# EAGLE design common_board_smd (EAGLE 6.5.0)
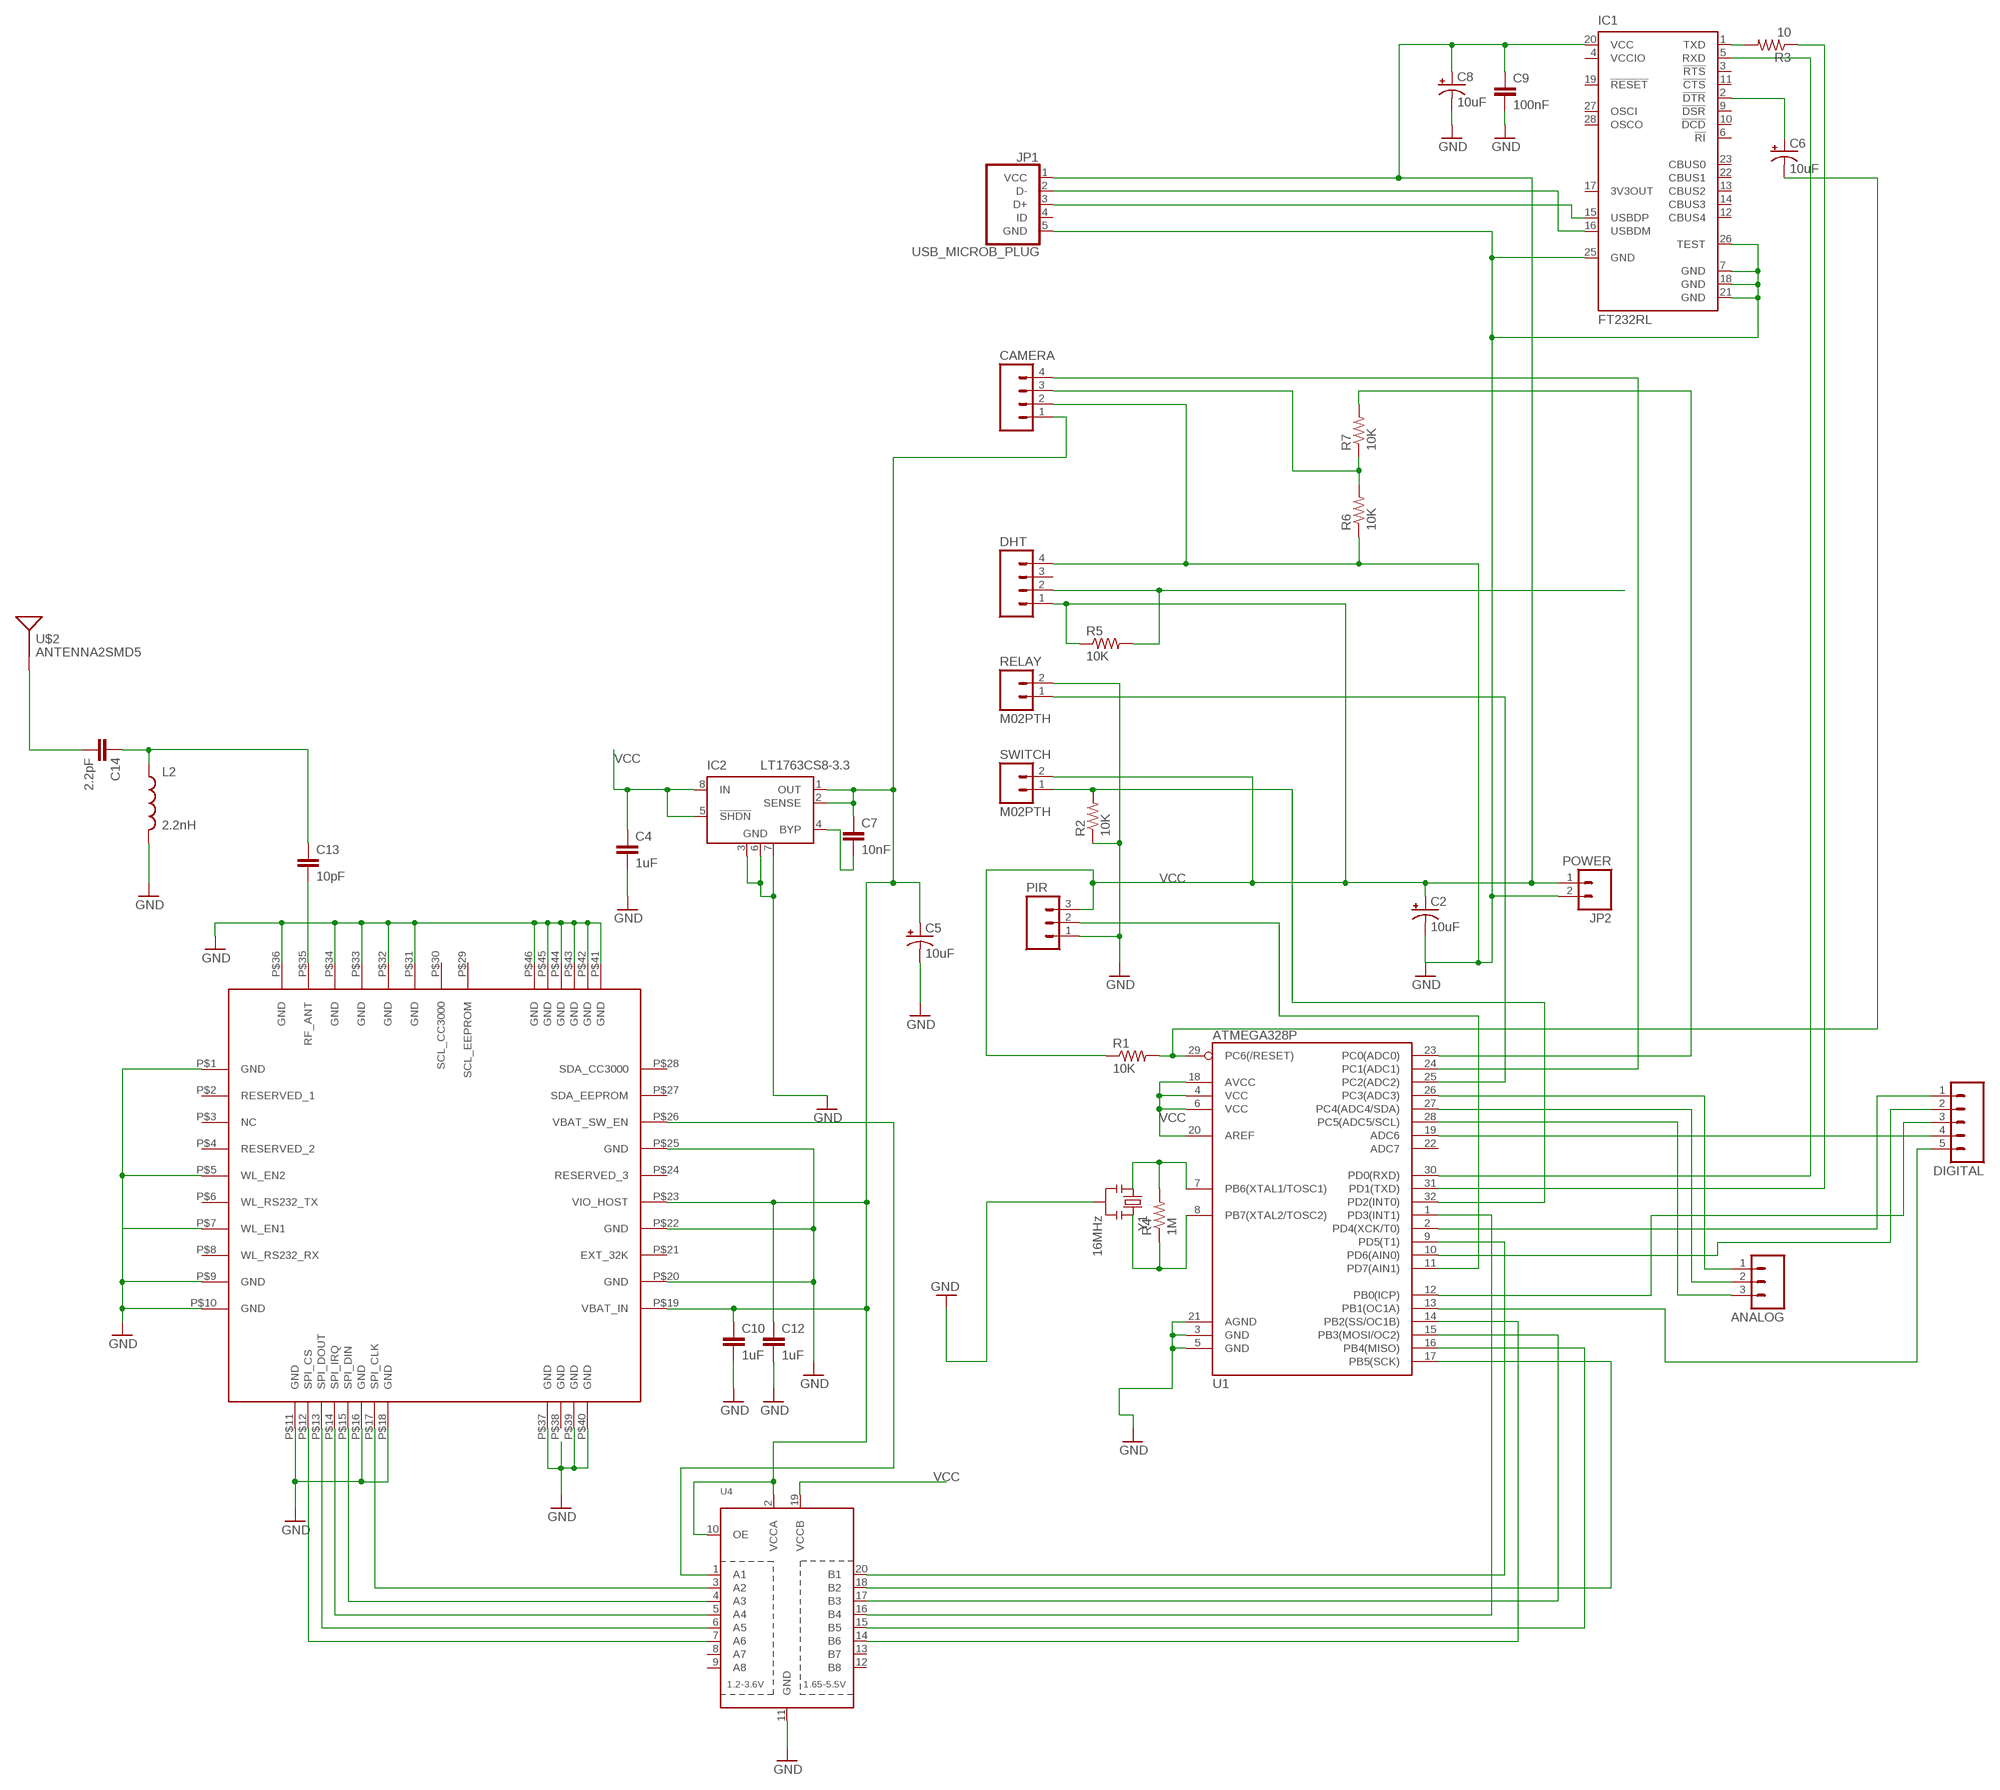
[diagram p0: schematic, sheet 1]

## Parts
ANALOG  M03PTH  [1X03]
C2  10uF  CAP_POL1206  [EIA3216]
C4  1uF  CAP0805  [0805]
C5  10uF  CAP_POL3528  [EIA3528]
C6  10uF  CAP_POL1206  [EIA3216]
C7  10nF  CAP0805  [0805]
C8  10uF  CAP_POL1206  [EIA3216]
C9  100nF  CAP0805  [0805]
C10  1uF  CAP1206  [1206]
C12  1uF  CAP1206  [1206]
C13  10pF  CAP0805  [0805]
C14  2.2pF  CAP0805  [0805]
CAMERA  M04PTH  [1X04]
DHT  M04PTH  [1X04]
DIGITAL  M05PTH  [1X05]
IC1  FT232RL  [SSOP28]
IC2  LT1763CS8-3.3  [SOIC8]
JP1  USB_MICROB_PLUG  [MICRO-B-RA-SMT]
JP2  POWER  M02PTH  [1X02]
L2  2.2nH  INDUCTOR0805  [0805]
PIR  M03PTH  [1X03]
R1  10K  RESISTOR0805-RES  [0805]
R2  10K  RESISTOR0805-RES  [0805]
R3  10  RESISTOR0805-RES  [0805]
R4  1M  RESISTOR0603-RES  [0603-RES]
R5  10K  RESISTOR0805-RES  [0805]
R6  10K  RESISTOR0805-RES  [0805]
R7  10K  RESISTOR0805-RES  [0805]
RELAY  M02PTH  [1X02]
SWITCH  M02PTH  [1X02]
U1  ATMEGA328P  ATMEGA328_SMT  [TQFP32-08]
U4  TXB0108PWR  [TSSOP20]
U$1  CC3000  [CC3000]
U$2  ANTENNA2SMD5  [ANTENNA-CHIP5]
Y1  16MHz  RESONATOR16MHZ  [RESONATOR-SMD]

## Nets
GND [gnd]: C2.C(-) C4.2 C5.C(-) C8.C(-) C9.2 C10.2 C12.2 CAMERA.2 DHT.4 IC1.7(GND) IC1.18(GND) IC1.21(GND) IC1.25(GND) IC1.26(TEST) IC2.3(GND) IC2.6(GND) IC2.7(GND) JP1.5(GND) JP2.2 L2.2 PIR.1 R2.1 R6.1 RELAY.2 U1.3(GND) U1.5(GND) U1.21(AGND) U4.11(GND) U$1.P$1(GND) U$1.P$5(WL_EN2) U$1.P$7(WL_EN1) U$1.P$9(GND) U$1.P$10(GND) U$1.P$11(GND) U$1.P$16(GND) U$1.P$18(GND) U$1.P$20(GND) U$1.P$22(GND) U$1.P$25(GND) U$1.P$31(GND) U$1.P$32(GND) U$1.P$33(GND) U$1.P$34(GND) U$1.P$36(GND) U$1.P$37(GND) U$1.P$39(GND) U$1.P$40(GND) U$1.P$41(GND) U$1.P$42(GND) U$1.P$43(GND) U$1.P$44(GND) U$1.P$45(GND) U$1.P$46(GND) Y1.2
N$1: U1.9(PD5(T1)) U4.20(B1)
N$2: U1.1(PD3(INT1)) U4.16(B4)
N$3: C6.C(-) R1.2 U1.29(PC6(/RESET))
N$4: R4.2 U1.7(PB6(XTAL1/TOSC1)) Y1.1
N$5: U1.17(PB5(SCK)) U4.18(B2)
N$6: U1.14(PB2(SS/OC1B)) U4.14(B6)
N$8: C5.A(+) C7.1 C10.1 C12.1 CAMERA.1 IC2.1(OUT) IC2.2(SENSE) U4.2(VCCA) U4.10(OE) U$1.P$19(VBAT_IN) U$1.P$23(VIO_HOST)
N$9: U4.7(A6) U$1.P$12(SPI_CS)
N$10: U4.6(A5) U$1.P$13(SPI_DOUT)
N$11: U4.5(A4) U$1.P$14(SPI_IRQ)
N$12: U4.4(A3) U$1.P$15(SPI_DIN)
N$13: U4.3(A2) U$1.P$17(SPI_CLK)
N$14: U4.1(A1) U$1.P$26(VBAT_SW_EN)
N$15: IC1.1(TXD) R3.2
N$16: C13.2 U$1.P$35(RF_ANT)
N$17: C13.1 C14.1 L2.1
N$18: C14.2 U$2.FEED(SIGNAL)
N$19: U1.16(PB4(MISO)) U4.15(B5)
N$20: U1.15(PB3(MOSI/OC2)) U4.17(B3)
N$21: R2.2 SWITCH.1 U1.32(PD2(INT0))
N$22: DHT.2 R5.2
N$23: RELAY.1 U1.25(PC2(ADC2))
N$24: CAMERA.3 R6.2 R7.1
N$25: R7.2 U1.23(PC0(ADC0))
N$26: PIR.2 U1.11(PD7(AIN1))
N$27: CAMERA.4 U1.24(PC1(ADC1))
N$28: IC1.15(USBDP) JP1.3(D+)
N$29: IC1.16(USBDM) JP1.2(D-)
N$30: R3.1 U1.31(PD1(TXD))
N$31: IC1.5(RXD) U1.30(PD0(RXD))
N$32: C6.A(+) IC1.2(!DTR)
N$33: ANALOG.1 U1.26(PC3(ADC3))
N$34: ANALOG.2 U1.27(PC4(ADC4/SDA))
N$35: ANALOG.3 U1.28(PC5(ADC5/SCL))
N$36: DIGITAL.5 U1.13(PB1(OC1A))
N$37: DIGITAL.3 U1.12(PB0(ICP))
N$38: DIGITAL.1 U1.2(PD4(XCK/T0))
N$39: DIGITAL.2 U1.10(PD6(AIN0))
N$40: DIGITAL.4 U1.19(ADC6)
N$41: R4.1 U1.8(PB7(XTAL2/TOSC2)) Y1.3
N$42: C7.2 IC2.4(BYP)
VCC [usbvcc]: C2.A(+) C4.1 C8.A(+) C9.1 DHT.1 IC1.20(VCC) IC2.5(!SHDN) IC2.8(IN) JP1.1(VCC) JP2.1 PIR.3 R1.1 R5.1 SWITCH.2 U1.4(VCC) U1.6(VCC) U1.18(AVCC) U1.20(AREF) U4.19(VCCB)
Unconnected: DHT.3 IC1.3(!RTS) IC1.6(!RI) IC1.9(!DSR) IC1.10(!DCD) IC1.11(!CTS) IC1.12(CBUS4) IC1.13(CBUS2) IC1.14(CBUS3) IC1.17(3V3OUT) IC1.19(!RESET) IC1.22(CBUS1) IC1.23(CBUS0) IC1.27(OSCI) IC1.28(OSCO) JP1.4(ID) U1.22(ADC7) U4.8(A7) U4.9(A8) U4.12(B8) U4.13(B7) U$1.P$2(RESERVED_1) U$1.P$3(NC) U$1.P$4(RESERVED_2) U$1.P$6(WL_RS232_TX) U$1.P$8(WL_RS232_RX) U$1.P$21(EXT_32K) U$1.P$24(RESERVED_3) U$1.P$27(SDA_EEPROM) U$1.P$28(SDA_CC3000) U$1.P$38(GND)

## Power pins joined to a net without a drawn wire
SCL_CC3000: U$1.P$30(SCL_CC3000)
SCL_EEPROM: U$1.P$29(SCL_EEPROM)
VCCIO: IC1.4(VCCIO)

## Library data of the parts
ANALOG PIR = SparkFun-Connectors:M03: Header 3 Standard 3-pin 0.1" header. Use with straight break away headers (SKU : PRT-00116), right angle break away headers (PRT-00553), swiss pins (PRT-00743), machine pins (PRT-00117), and female headers (PRT-00115). Molex polarized connector foot print use with SKU : PRT-08232 with associated crimp pins and housings.
C2 C5 C6 C8 = SparkFun-Passives:CAP_POL: Capacitor Polarized These are standard SMD and PTH capacitors. Normally 10uF, 47uF, and 100uF in electrolytic and tantalum varieties. Always verify the external diameter of the through hole cap, it varies with capacity, voltage, and manufacturer. The EIA devices should be standard.
C4 C7 C9 C10 C12-C14 = SparkFun-Capacitors:CAP: Capacitor Standard 0603 ceramic capacitor, and 0.1" leaded capacitor.
CAMERA DHT = SparkFun-Connectors:M04: Header 4 Standard 4-pin 0.1" header. Use with straight break away headers (SKU : PRT-00116), right angle break away headers (PRT-00553), swiss pins (PRT-00743), machine pins (PRT-00117), and female headers (PRT-00115). Molex polarized connector foot print use with SKU : PRT-08231 with associated crimp pins and housings. 1MM SMD Version SKU: PRT-10208
DIGITAL = SparkFun-Connectors:M05: Header 5 Standard 5-pin 0.1" header. Use with straight break away headers (SKU : PRT-00116), right angle break away headers (PRT-00553), swiss pins (PRT-00743), machine pins (PRT-00117), and female headers (PRT-00115). Molex polarized connector foot print use with SKU : PRT-08230 with associated crimp pins and housings.
IC1 = ftdichip:FT232R: Source: http://www.ftdichip.com/Documents/DataSheets/DS_FT232R_v104.pdf; MPN: FT232RL; OC_FARNELL: 1146032; OC_NEWARK: 91K9918
IC2 = linear-technology:LT1763CS8: 500mA, Low Noise, LDO Micropower Regulators Source: http://cds.linear.com/docs/Datasheet/1763ff.pdf; MPN: LT1763CS8-3.3; OC_FARNELL: 1273617; OC_NEWARK: 57M6055
JP1 = SparkFun-Connectors:USB_MICROB_PLUG: USB Micro-B Plug Comes in a variety of packages. Check out Hirose's ZX-x0 line: http://www.hirose.co.jp/cataloge_hp/e24200011.pdf
JP2 RELAY SWITCH = SparkFun-Connectors:M02: Standard 2-pin 0.1" header. Use with - straight break away headers ( PRT-00116) - right angle break away headers (PRT-00553) - swiss pins (PRT-00743) - machine pins (PRT-00117) - female headers (PRT-00115) Molex polarized connector foot print use with: PRT-08233 with associated crimp pins and housings. 2.54_SCREWTERM for use with PRT-10571. 3.5mm Screw Terminal footprints for PRT-08084 5mm Screw Terminal footprints for use with PRT-08433
L2 = SparkFun-Passives:INDUCTOR: Inductors Basic Inductor/Choke - 0603 and 1206. Footprints are not proven and vary greatly between part numbers. SRN6045- 33uH, 20% 1.4A
R1-R3 R5-R7 = SparkFun-Passives:RESISTOR: Resistor Basic schematic elements and footprints for 0603, 1206, and PTH resistors.
R4 = SparkFun-Resistors:RESISTOR: Resistor Basic schematic elements and footprints for 0603, 1206, and PTH resistors.
U1 = SparkFun-DigitalIC:ATMEGA328_SMT: 32-Pin Atmega328 part Commonly used on Arduino compatible boards Available in QFP and QFN packages TQFP is IC-09069 QFN is non-stock; PROD_ID: IC-09069
U4 = adafruit:TXB0108PWR: 8-Bit Bi-Directional Level Shifter 1.2V-3.6V (VCCA) to 1.65V-5.5V (VCCB) bi-directional level shifter with auto direction sensing. Max data rate - VCCA 1.8V: 20Mbps (50ns), VCCA 3.3V: 100Mbps (10ns) Digikey: 296-21527-1-ND
U$1 = centerblack_engineering:CC3000: TI SimpleLink CC3000 Module - WiFi 802.11b/g Network Processor; AUTHOR: Matt Bigarani; DATASHEET: http://www.ti.com/lit/ds/symlink/cc3000.pdf; DATE: 2/8/2013
U$2 = SparkFun-RF-Modified:ANTENNA2: Chip antenna Single endded antenna. Common with smaller chip antennas. CHIP4 package is the GPS Chip Antenna SKU: GPS-08418. CHIP5 package is 2.4GHz chip antenna SKU: WRL-00144.
Y1 = SparkFun-FreqCtrl:RESONATOR: Resonator Small SMD resonator. Used, eg, on the Arduino Pro/ Pro Mini boards. 8MHz- XTAL-08895 16MHz- XTAL-08900; PROD_ID: XTAL-08900

## Net classes
0 default: width 0.152 mm, clearance 0.152 mm
1 power: width 0.61 mm, drill 0.61 mm, clearance 0.254 mm
2 gnd: width 0.203 mm, drill 0.559 mm, clearance 0.152 mm
3 usbvcc: width 0.203 mm, drill 0.61 mm, clearance 0.152 mm
4 aref: width 0.406 mm, drill 0.61 mm, clearance 0.254 mm

## Board
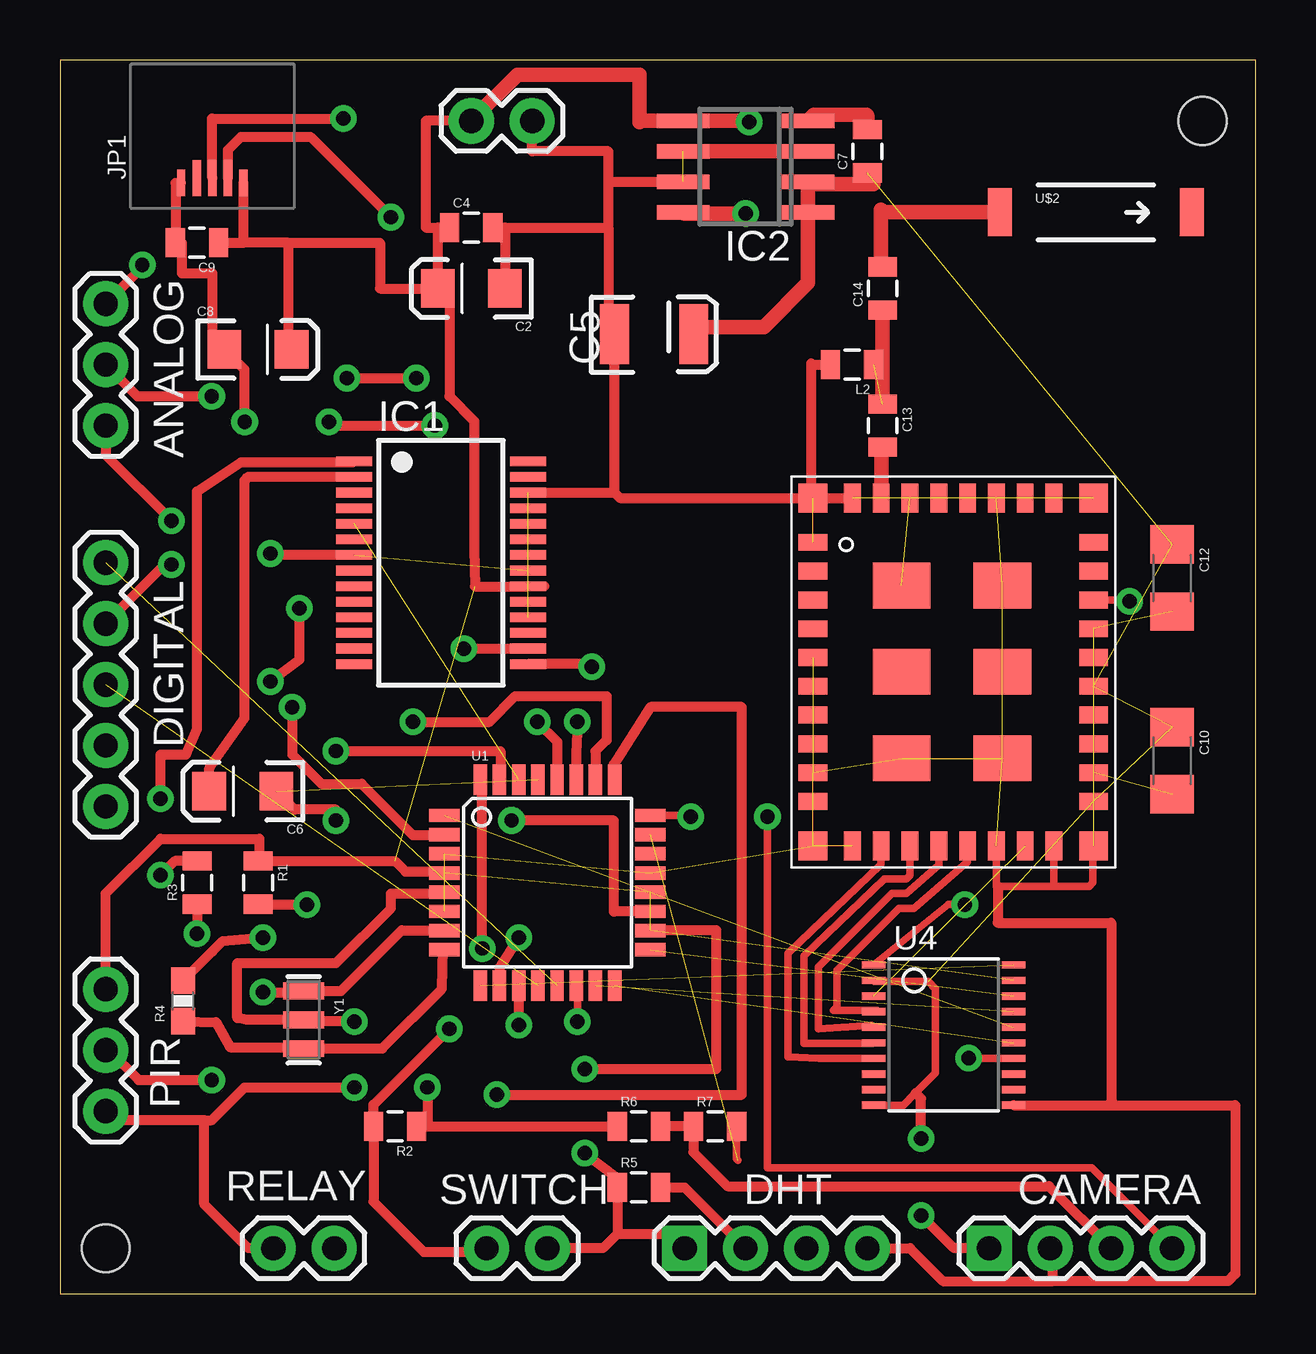
[diagram p1: board, top side]
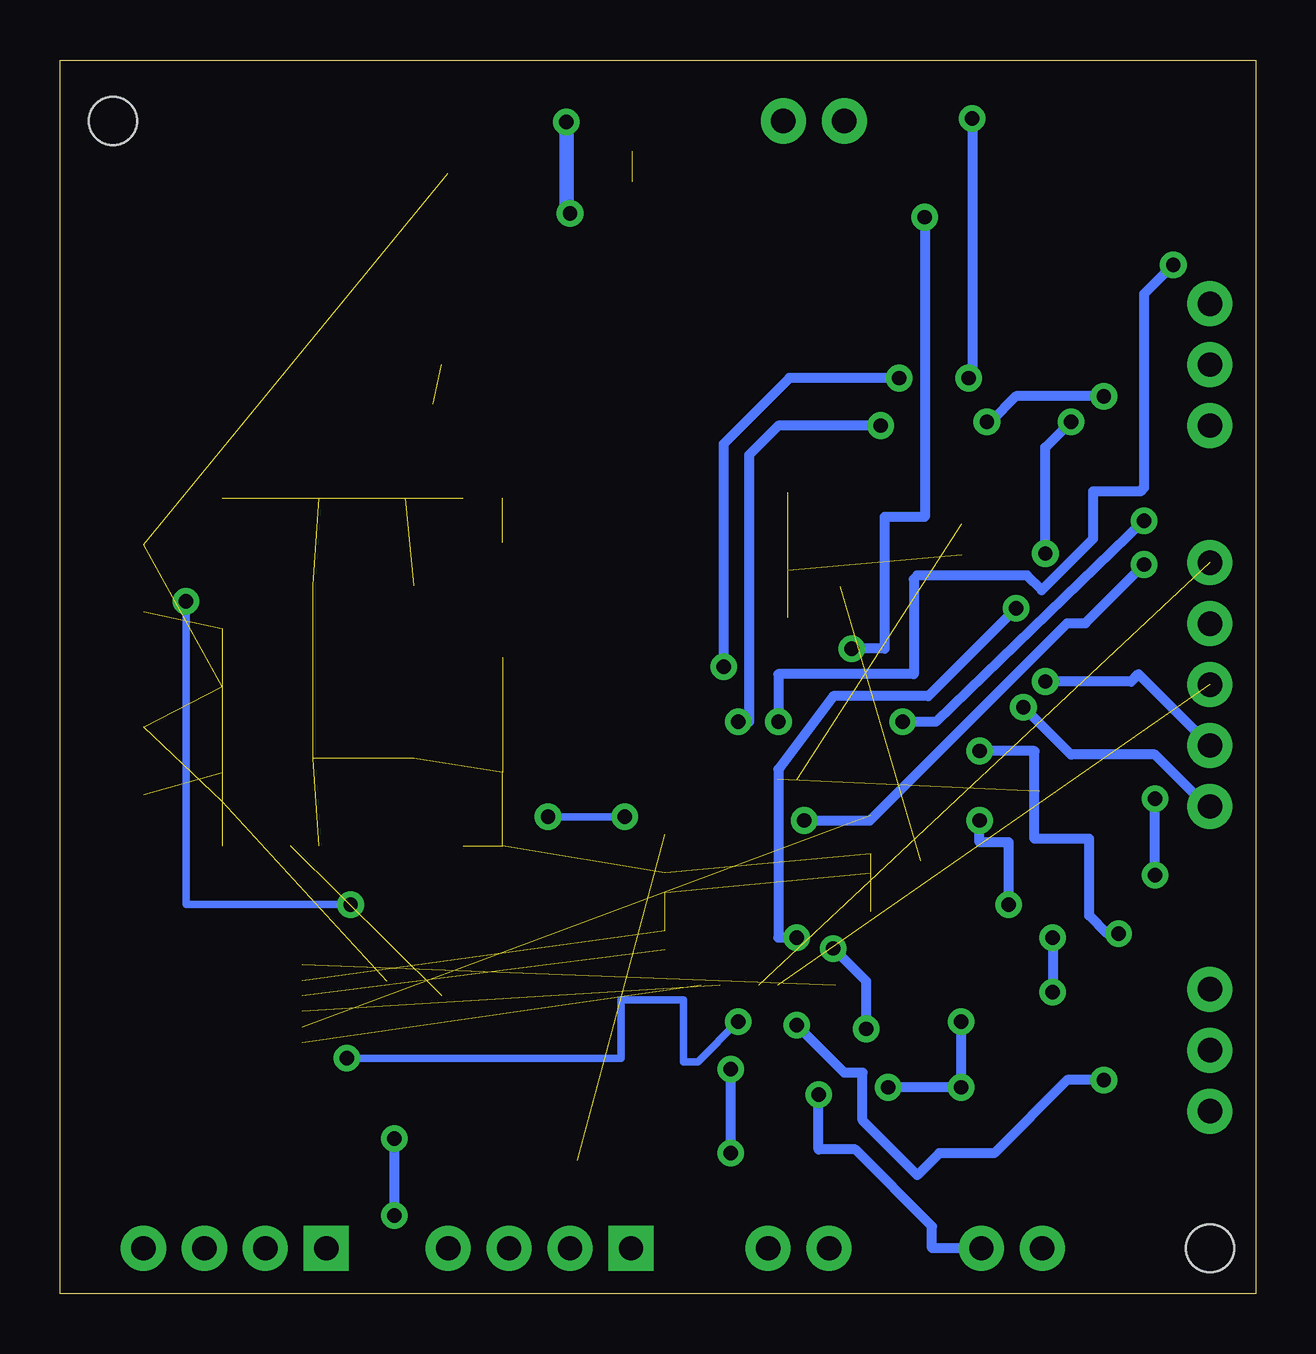
[diagram p2: board, bottom side, seen from below]

Size 49.84 x 51.43 mm. Coordinates in mm from the lower left corner, seen from the top.
Outline: 0,0 49.84,0 49.84,51.43 0,51.43 0,0
Copper layers (1*16): Top 0.035mm / dielectric 1.5mm / Bottom 0.035mm
Design rules "SparkFun *": minimum track width 12mil, minimum drill 19mil, track to track 8mil, track to pad 8mil, pad to pad 8mil, via to via 8mil, smd to smd 8mil, copper to edge 10mil, drill to drill 8mil, minimum pad ring 12mil, minimum via ring 10mil, stop-mask expansion 4mil, vias tented up to drill 25mil, thermal gap 10mil
Holes 2 mm at 1.91,1.91 47.62,48.9

### Footprints (pad centres in the part's own frame; a part is rotated, then mirrored left to right if it is on the bottom)
1X03 = drill 1.016 pad 1.88: 1 0,0; 2 2.54,0; 3 5.08,0
EIA3216 = smd 1.4 x 1.6: A 1.4,0; C -1.4,0
0805 = smd 0.8 x 1.2: 1 -0.9,0; 2 0.9,0
EIA3528 = smd 1.2 x 2.5: A 1.65,0; C -1.65,0
1206 = smd 1.6 x 1.8: 1 -1.4,0; 2 1.4,0
1X04 = drill 1.016 pad 1.88 square: 1 0,0 | drill 1.016 pad 1.88: 2 2.54,0; 3 5.08,0; 4 7.62,0
1X05 = drill 1.016 pad 1.88: 1 0,0; 2 2.54,0; 3 5.08,0; 4 7.62,0; 5 10.16,0
SSOP28 = smd 0.4 x 1.5: 1 -4.225,-3.625; 2 -3.575,-3.625; 3 -2.925,-3.625; 4 -2.275,-3.625; 5 -1.625,-3.625; 6 -0.975,-3.625; 7 -0.325,-3.625; 8 0.325,-3.625; 9 0.975,-3.625; 10 1.625,-3.625; 11 2.275,-3.625; 12 2.925,-3.625; 13 3.575,-3.625; 14 4.225,-3.625; 15 4.225,3.625; 16 3.575,3.625; 17 2.925,3.625; 18 2.275,3.625; 19 1.625,3.625; 20 0.975,3.625; 21 0.325,3.625; 22 -0.325,3.625; 23 -0.975,3.625; 24 -1.625,3.625; 25 -2.275,3.625; 26 -2.925,3.625; 27 -3.575,3.625; 28 -4.225,3.625
SOIC8 = smd 0.6 x 2.2: 1 -1.905,-2.6; 2 -0.635,-2.6; 3 0.635,-2.6; 4 1.905,-2.6; 5 1.905,2.6; 6 0.635,2.6; 7 -0.635,2.6; 8 -1.905,2.6
MICRO-B-RA-SMT = smd 0.35 x 1.1: 1 1.3,-1.95; 5 -1.3,-1.95 | smd 0.35 x 1.5: 2 0.65,-1.75; 3 0,-1.75; 4 -0.65,-1.75
1X02 = drill 1.016 pad 1.88: 1 0,0; 2 2.54,0
0603-RES = smd 1.1 x 1: 1 -0.85,0; 2 0.85,0
TQFP32-08 = smd 1.27 x 0.559: 1 -4.293,2.8; 2 -4.293,2; 3 -4.293,1.2; 4 -4.293,0.4; 5 -4.293,-0.4; 6 -4.293,-1.2; 7 -4.293,-2; 8 -4.293,-2.8; 17 4.293,-2.8; 18 4.293,-2; 19 4.293,-1.2; 20 4.293,-0.4; 21 4.293,0.4; 22 4.293,1.2; 23 4.293,2; 24 4.293,2.8 | smd 0.559 x 1.27: 9 -2.8,-4.293; 10 -2,-4.293; 11 -1.2,-4.293; 12 -0.4,-4.293; 13 0.4,-4.293; 14 1.2,-4.293; 15 2,-4.293; 16 2.8,-4.293; 25 2.8,4.293; 26 2,4.293; 27 1.2,4.293; 28 0.4,4.293; 29 -0.4,4.293; 30 -1.2,4.293; 31 -2,4.293; 32 -2.8,4.293
TSSOP20 = smd 0.305 x 0.991: 1 -2.925,-2.918; 2 -2.275,-2.918; 3 -1.625,-2.918; 4 -0.975,-2.918; 5 -0.325,-2.918; 6 0.325,-2.918; 7 0.975,-2.918; 8 1.625,-2.918; 9 2.275,-2.918; 10 2.925,-2.918; 11 2.925,2.918; 12 2.275,2.918; 13 1.625,2.918; 14 0.975,2.918; 15 0.325,2.918; 16 -0.325,2.918; 17 -0.975,2.918; 18 -1.625,2.918; 19 -2.275,2.918; 20 -2.925,2.918
CC3000 = smd 1.2 x 0.7: P$1 0.9,13.55; P$2 0.9,12.35; P$3 0.9,11.15; P$4 0.9,9.95; P$5 0.9,8.75; P$6 0.9,7.55; P$7 0.9,6.35; P$8 0.9,5.15; P$9 0.9,3.95; P$10 0.9,2.75; P$19 12.6,2.75; P$20 12.6,3.95; P$21 12.6,5.15; P$22 12.6,6.35; P$23 12.6,7.55; P$24 12.6,8.75; P$25 12.6,9.95; P$26 12.6,11.15; P$27 12.6,12.35; P$28 12.6,13.55 | smd 0.7 x 1.2: P$11 2.55,0.9; P$12 3.75,0.9; P$13 4.95,0.9; P$14 6.15,0.9; P$15 7.35,0.9; P$16 8.55,0.9; P$17 9.75,0.9; P$18 10.95,0.9; P$29 10.95,15.4; P$30 9.75,15.4; P$31 8.55,15.4; P$32 7.35,15.4; P$33 6.15,15.4; P$34 4.95,15.4; P$35 3.75,15.4; P$36 2.55,15.4 | smd 2.4 x 1.9: P$37 4.6,11.75; P$38 4.6,8.15; P$39 4.6,4.55; P$40 8.8,11.75; P$41 8.8,8.15; P$42 8.8,4.55 | smd 1.2 x 1.2: P$43 0.9,15.4; P$44 0.9,0.9; P$45 12.6,0.9; P$46 12.6,15.4
ANTENNA-CHIP5 = smd 1 x 2: FEED -4,0; NC 4,0
RESONATOR-SMD = smd 0.7 x 1.7: 1 -1.2,0; 2 0,0; 3 1.2,0

### Placement (x,y rotation side)
ANALOG  1.91,36.2 90 top
C2  17.14,41.91 180 top
C4  17.14,44.45 0 top
C5  24.77,40.01 0 top
C6  7.62,20.96 180 top
C7  33.66,47.63 90 top
C8  8.25,39.37 0 top
C9  5.71,43.82 180 top
C10  46.36,22.23 270 top
C12  46.36,29.84 270 top
C13  34.29,36.2 270 top
C14  34.29,41.91 90 top
CAMERA  38.73,1.91 0 top
DHT  26.04,1.91 0 top
DIGITAL  1.91,20.32 90 top
IC1  15.88,30.48 270 top
IC2  28.58,46.99 90 top
JP1  6.35,48.26 0 top
JP2  17.14,48.9 0 top
L2  33.02,38.74 180 top
PIR  1.91,7.62 90 top
R1  8.25,17.15 270 top
R2  13.97,6.98 180 top
R3  5.71,17.15 90 top
R4  5.13,12.22 90 top
R5  24.13,4.45 0 top
R6  24.13,6.98 0 top
R7  27.3,6.98 0 top
RELAY  11.43,1.91 180 top
SWITCH  17.78,1.91 0 top
U1  20.32,17.15 0 top
U4  36.83,10.8 270 top
U$1  30.48,17.78 0 top
U$2  43.18,45.09 0 top
Y1  10.16,11.43 270 top

### Tracks (layer width: path | path; a pad name or v marks a point on that pad's centre or on a via)
GND  (via drill 0.6)  (31 unrouted)
  Top 0.305: U$1.P$16 39.03,17.05 39.09,16.99 41.53,16.99 | 41.53,16.99 42.9,16.99 43.05,17.15 43.05,18.65 U$1.P$45 | U$1.P$18 41.43,17.09 41.53,16.99
  Top 0.406: JP1.5 4.82,46.31 C9.2 5.08,43.82 5.08,42.55 6.35,42.55 6.35,39.88 C8.C | 22.86,44.45 C4.2 18.55,44.45 C2.C | 22.86,44.45 22.86,46.35 | 22.86,46.35 IC2.7 | 22.86,46.35 22.86,47.63 19.69,47.63 JP2.2 | 22.86,44.45 22.86,40.64 23.12,40.64 C5.C 23.12,33.41 | IC1.26 23.12,33.41 | U1.5 15.97,16.69 13.79,16.69 13.79,16.08 11.51,13.79 7.39,13.79 7.39,11.51 7.77,11.43 Y1.2 10.24,11.35 v12.27,11.35 | RELAY.2 7.85,1.91 6.02,3.73 6.02,7.24 | 6.02,7.24 2.29,7.24 PIR.1 | 6.02,7.24 6.33,7.24 7.7,8.61 v12.27,8.61 | R6.1 R2.1 15.32,7.13 v15.32,8.61 | C8.C 6.96,39.37 | 6.96,39.37 7.09,39.24 | 6.96,39.37 6.78,39.55 | IC1.7 8.82,30.8 v8.76,30.86 | v7.7,36.35 7.7,38.53 C8.C | DHT.4 35.43,1.91 36.8,0.53 41.38,0.53 | 41.38,0.53 41.38,1.8 CAMERA.2 | U4.11 43.97,7.87 | 43.97,7.87 48.98,7.87 49,7.85 49,0.84 48.69,0.53 41.38,0.53 | 39.09,16.99 39.09,15.47 43.81,15.47 43.81,8.02 43.97,7.87 | U$1.P$43 31.32,33.24 31.32,38.79 31.37,38.74 L2.2 | 23.12,33.41 23.34,33.18 U$1.P$43 | U$1.P$43 U$1.P$36
  Top 0.61: IC2.6 IC2.3
  Bottom 0.406: v12.27,11.35 v12.27,8.61 v15.32,8.61 | v8.76,30.86 8.76,35.28 v7.7,36.35
N$1  (1 unrouted)
N$2  (1 unrouted)
N$3  (via drill 0.6)  (1 unrouted)
  Top 0.406: R1.2 10.27,16.25 v10.29,16.23 | v11.51,19.74 11.51,20.19 9.78,20.19 C6.C
  Bottom 0.406: v10.29,16.23 10.29,18.82 11.51,18.82 v11.51,19.74
N$4  (via drill 0.6)
  Top 0.406: U1.7 16.01,15.16 14.25,15.16 11.72,12.63 Y1.1 10.1,12.57 v8.46,12.57 | R4.2 6.35,14.27 6.78,14.71 v8.46,14.86
  Bottom 0.406: v8.46,14.86 v8.46,12.57
N$5  (1 unrouted)
N$6  (via drill 0.6)
  Top 0.305: U4.14 39.74,9.83 v37.87,9.83 | v21.57,11.35 21.57,12.81 U1.14
  Bottom 0.305: v37.87,9.83 26.44,9.83 26.44,12.27 23.85,12.27 23.85,9.68 23.24,9.68 v21.57,11.35
N$8  (via drill 0.6)  (5 unrouted)
  Top 0.305: U4.10 35.15,7.87 35.66,8.38 36.5,9.22 36.5,12.73 36.2,13.03 33.95,13.03 U4.2
  Top 0.406: CAMERA.1 37.26,1.91 v35.89,3.28 | v35.89,6.48 35.89,8.15 35.66,8.38
  Top 0.61: C7.1 33.66,46.51 33.91,46.25 31.28,46.25 IC2.2 IC2.1 31.18,42.15 29.34,40.31 26.72,40.31 C5.A
  Bottom 0.406: v35.89,3.28 v35.89,6.48
N$9
  Top 0.305: U4.7 31.63,9.82 30.35,9.88 30.35,14.19 34.21,17.91 34.21,18.68 U$1.P$12
N$10
  Top 0.305: U$1.P$13 35.43,17.45 35.28,17.3 34.37,17.3 31.01,14.1 31.01,10.44 33.88,10.44 U4.6
N$11
  Top 0.305: U4.5 33.83,11.2 31.62,11.05 31.62,13.64 34.67,16.69 35.28,16.69 36.63,17.89 U$1.P$14
N$12
  Top 0.305: U4.4 33.95,11.81 | 33.95,11.81 34.06,11.81 | 33.95,11.81 32.23,11.81 32.38,11.96 32.38,13.49 34.98,16.08 35.59,16.08 37.83,18.02 U$1.P$15
N$13  (1 unrouted)
N$14  (via drill 0.6)
  Top 0.305: U4.1 37.03,16.23 v37.72,16.23 | v44.58,28.88 44.53,28.93 U$1.P$26
  Bottom 0.305: v37.72,16.23 44.58,16.23 v44.58,28.88
N$15  (via drill 0.6)
  Top 0.406: R3.2 4.79,18.05 v4.19,17.45 | v4.19,20.65 4.19,22.48 5.26,22.48 5.71,23.55 5.71,33.45 7.54,34.67 12.22,34.67 IC1.1
  Bottom 0.406: v4.19,17.45 v4.19,20.65
N$16
  Top 0.61: C13.2 34.23,35.24 U$1.P$35
N$17  (1 unrouted)
  Top 0.61: C13.1 C14.1
N$18
  Top 0.61: C14.2 34.21,42.89 34.21,45.19 34.31,45.09 U$2.FEED
N$19  (1 unrouted)
N$20  (1 unrouted)
N$21  (via drill 0.6)
  Top 0.406: SWITCH.1 17.63,1.75 15.16,1.75 13.07,3.85 R2.2 13.07,7.89 v16.23,11.05 | v17.6,14.4 17.6,21.36 U1.32
  Bottom 0.406: v16.23,11.05 16.23,13.03 v17.6,14.4
N$22
  Top 0.406: R5.2 26.04,4.45 DHT.2
N$23  (via drill 0.6)
  Top 0.406: v18.21,8.31 28.42,8.31 28.42,24.46 24.61,24.46 23.09,22.08 U1.25
  Bottom 0.406: RELAY.1 13.49,1.91 13.49,2.82 16.69,6.02 18.21,6.02 v18.21,8.31
N$24
  Top 0.406: R6.2 R7.1 26.41,5.9 27.81,4.5 41.22,4.5 CAMERA.3
N$25  (1 unrouted)
  Top 0.305: R7.2 28.21,5.63 28.27,5.56
N$26  (via drill 0.6)
  Top 0.406: PIR.2 2.03,10.16 3.28,8.91 v6.33,8.91 | v19.13,11.2 U1.11
  Bottom 0.406: v6.33,8.91 7.85,8.91 10.9,5.87 13.18,5.87 14.1,4.95 16.38,7.24 16.38,9.22 17.14,9.22 v19.13,11.2
N$27  (via drill 0.6)
  Top 0.305: CAMERA.4 43,5.26 29.49,5.26 v29.49,19.89 | v26.29,19.89 26.23,19.95 U1.24
  Bottom 0.305: v29.49,19.89 v26.29,19.89
N$28  (via drill 0.6)
  Top 0.406: JP1.3 6.35,48.97 6.33,49 v11.81,49 | v11.96,38.18 v14.86,38.18 | v22.17,26.14 22.06,26.26 IC1.15
  Bottom 0.406: v11.81,49 11.81,38.33 v11.96,38.18 | v14.86,38.18 19.43,38.18 22.17,35.43 v22.17,26.14
N$29  (via drill 0.6)
  Top 0.406: JP1.2 7,47.69 7.54,48.24 10.44,48.24 v13.79,44.88 | v16.84,26.9 IC1.16
  Bottom 0.406: v13.79,44.88 13.79,32.38 15.47,32.38 15.47,26.9 v16.84,26.9
N$30  (via drill 0.6)
  Top 0.406: R3.1 v5.71,15.01 | v11.51,22.63 18.36,22.63 18.36,21.48 U1.31
  Bottom 0.406: v5.71,15.01 6.17,15.01 6.93,15.77 6.93,18.97 9.22,18.97 9.22,22.63 v11.51,22.63
N$31  (1 unrouted)
N$32
  Top 0.406: C6.A 6.22,21.92 7.7,24 7.7,33.91 7.85,34.06 IC1.2
N$33  (via drill 0.6)
  Top 0.406: ANALOG.1 1.91,34.98 v4.65,32.23 | 22.33,21.44 U1.26 22.32,22.62 22.78,23.09 22.78,24.92 18.97,24.92 17.91,23.85 v14.71,23.85
  Bottom 0.406: v4.65,32.23 13.33,23.85 v14.71,23.85
N$34  (via drill 0.6)
  Top 0.406: ANALOG.2 3.23,37.41 v6.33,37.41 | v11.2,36.35 11.35,36.2 v15.62,36.2 | v21.57,23.85 21.52,22.52 U1.27
  Bottom 0.406: v6.33,37.41 9.98,37.41 11.05,36.35 v11.2,36.35 | v15.62,36.2 19.89,36.2 21.11,34.98 21.11,23.85 v21.57,23.85
N$35  (via drill 0.6)
  Top 0.406: ANALOG.3 3.43,42.8 v3.43,42.9 | v19.89,23.85 20.72,23.02 U1.28
  Bottom 0.406: v3.43,42.9 4.65,41.68 4.65,33.6 4.8,33.45 6.78,33.45 6.78,31.47 8.91,29.34 9.53,29.95 14.1,29.95 14.25,29.79 14.25,25.83 19.89,25.83 v19.89,23.85
N$36  (1 unrouted)
N$37  (1 unrouted)
N$38  (via drill 0.6)
  Top 0.406: v9.68,24.46 9.68,22.48 10.9,21.26 12.57,21.26 14.71,19.13 16.01,19.13 U1.2
  Bottom 0.406: DIGITAL.1 2.03,20.32 4.19,22.48 7.7,22.48 v9.68,24.46
N$39  (via drill 0.6)
  Top 0.406: v19.13,14.86 18.32,13.6 U1.10 | v8.76,25.53 9.98,26.44 v9.98,28.58
  Bottom 0.406: DIGITAL.2 4.88,25.83 5.18,25.53 v8.76,25.53 | v9.98,28.58 13.64,24.92 17.6,24.92 19.89,21.87 19.89,14.86 v19.13,14.86
N$40  (via drill 0.6)
  Top 0.406: U1.19 23.11,15.95 23.09,15.93 23.09,19.74 v18.82,19.74 | v4.65,30.4 4.37,30.4 DIGITAL.4
  Bottom 0.406: v18.82,19.74 16.08,19.74 7.85,27.97 7.09,27.97 v4.65,30.4
N$41
  Top 0.406: U1.8 15.97,14.4 15.93,12.73 13.43,10.23 Y1.3 10.1,10.29 7.09,10.29 6.5,11.33 R4.1
N$42
  Top 0.61: IC2.4 31.43,49.15 33.6,49.15 33.66,49.1 C7.2
VCC  (via drill 0.6)  (5 unrouted)
  Top 0.406: C9.1 7.65,43.82 | 7.65,43.82 JP1.1 | C8.A 9.53,39.37 9.53,43.82 | 9.53,43.82 7.65,43.82 | 9.53,43.82 13.33,43.82 13.33,41.91 C2.A | JP2.1 15.24,48.9 15.24,44.45 C4.1 15.74,44.45 C2.A | 19.52,29.49 17.3,29.49 17.27,31.04 17.27,36.38 16.23,37.41 16.23,41.42 C2.A | 20.19,29.49 19.52,29.49 | 19.52,29.49 IC1.20 | PIR.3 1.91,16.69 4.19,18.97 8.31,18.97 8.31,18.1 R1.1 13.96,18.05 14.4,17.6 15.97,17.6 U1.4 | 23.23,2.5 R5.1 23.23,4.81 v21.87,5.87 | 23.23,2.5 22.63,1.91 SWITCH.2 | 23.23,2.5 25.44,2.5 DHT.1 | v21.87,9.37 27.36,9.37 27.36,15.16 24.63,15.16 U1.18
  Top 0.61: JP2.1 19.08,50.82 24.16,50.82 24.16,48.84 24.21,48.9 IC2.5 28.68,48.9 v28.73,48.84 | IC2.8 26.03,45.03 v28.58,45.03
  Bottom 0.406: v21.87,5.87 v21.87,9.37
  Bottom 0.61: v28.58,45.03 28.73,45.19 v28.73,48.84